# Altium schematic sheet 1-MCU.SchDoc
size A3
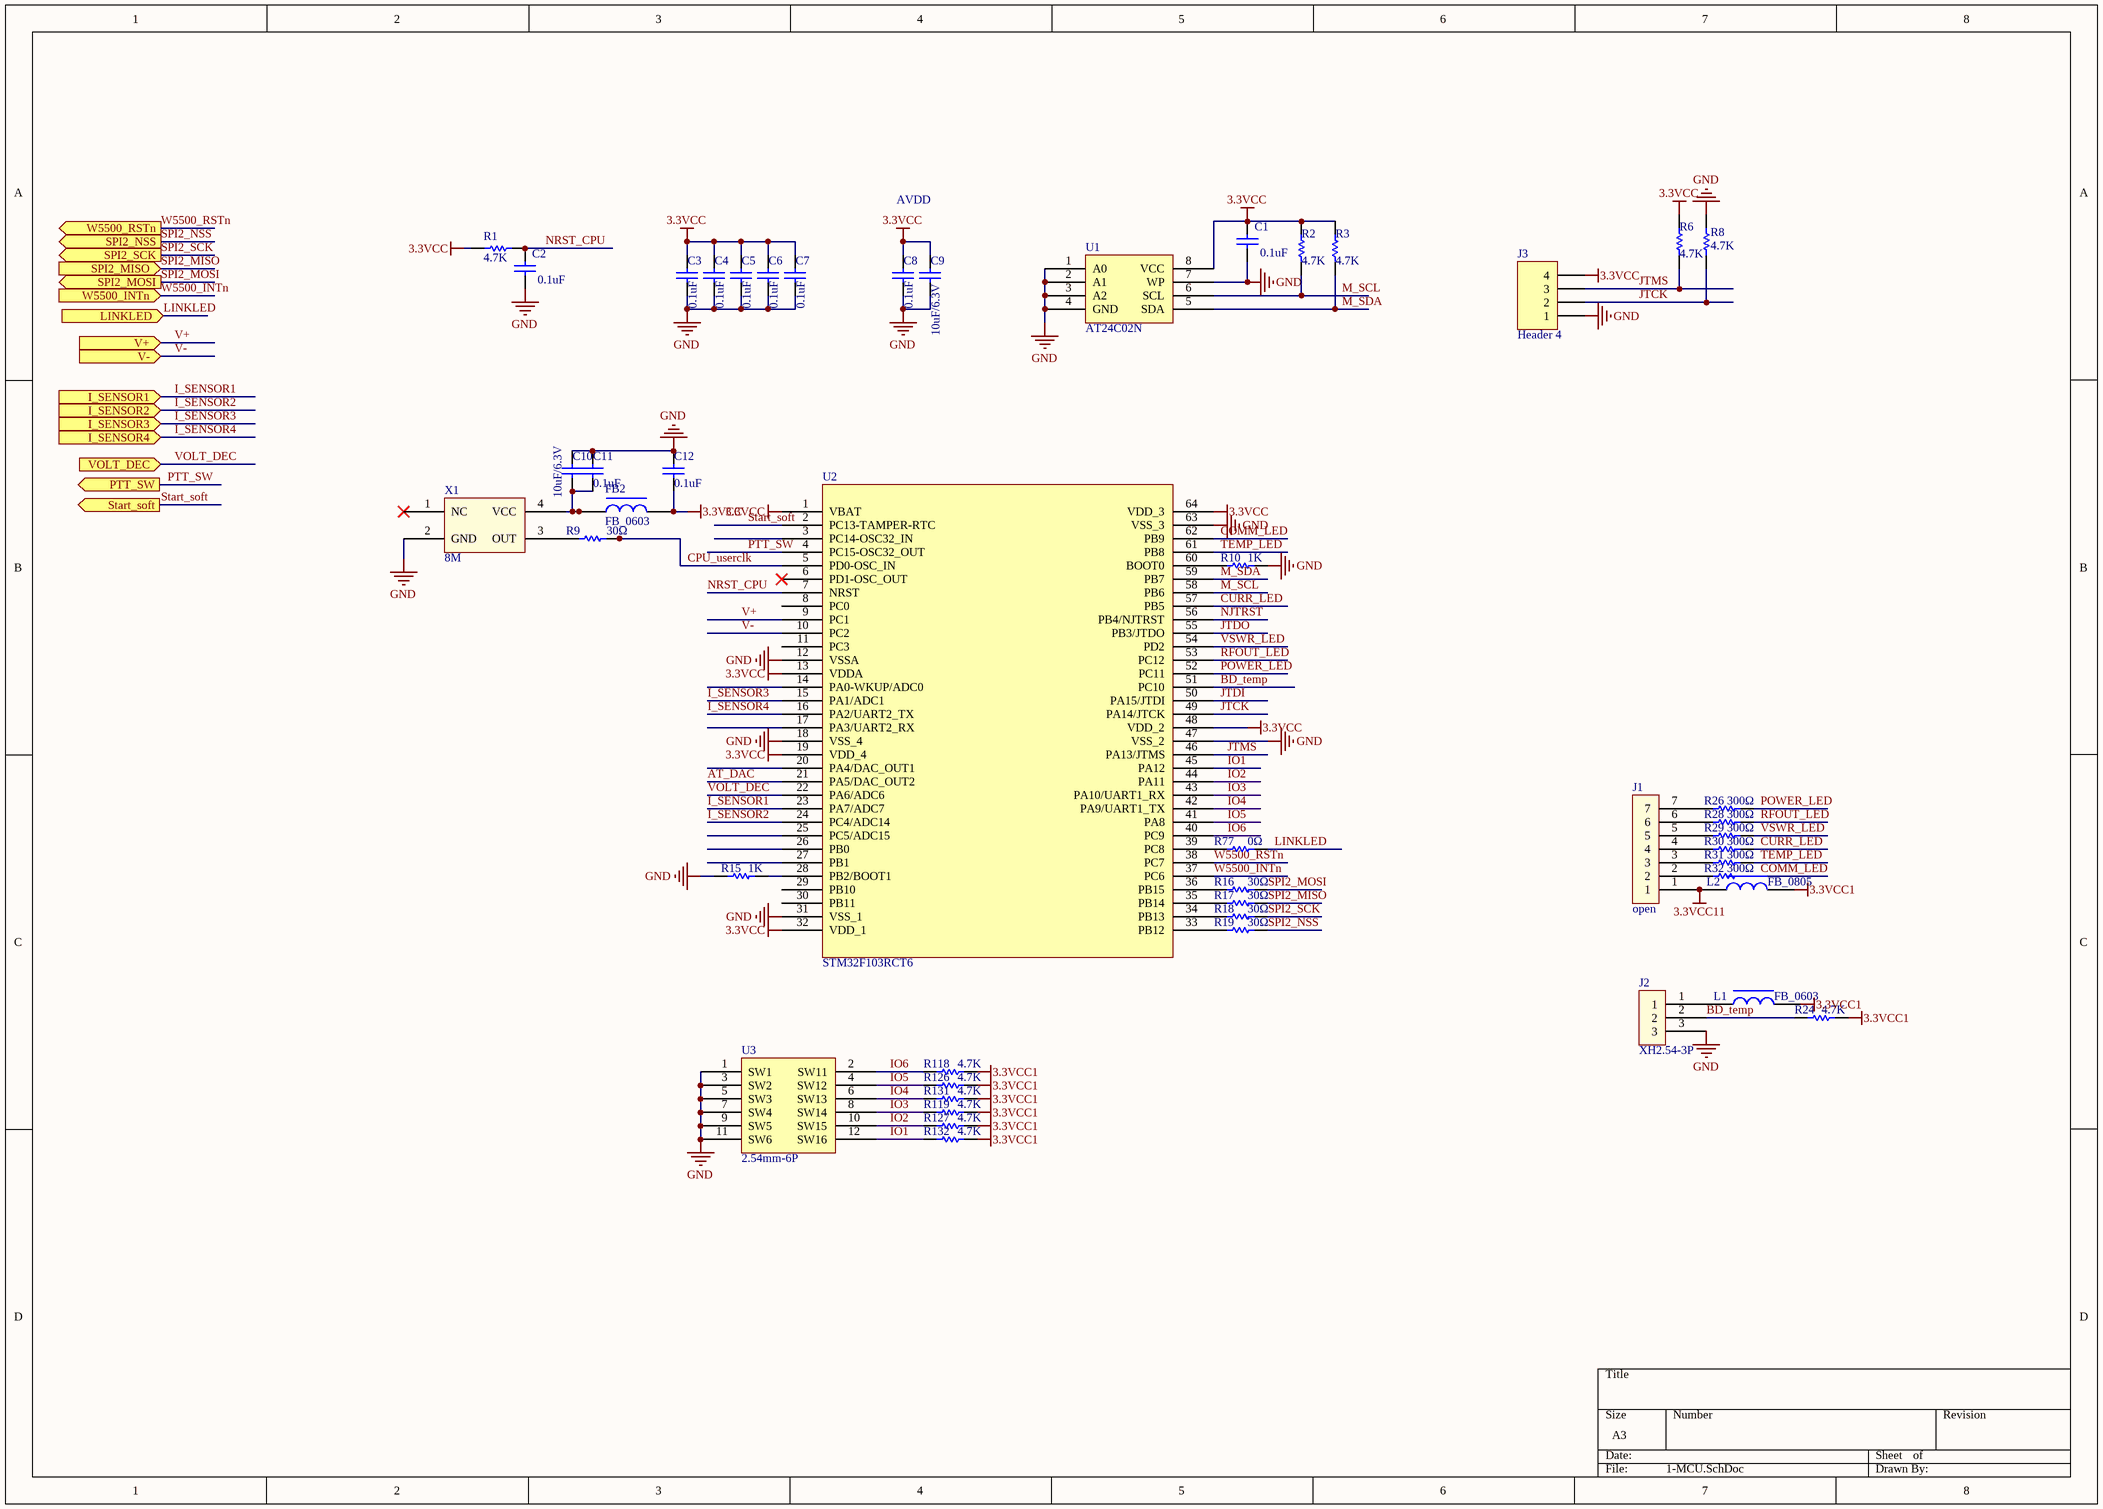
[diagram p0: 1-MCU.SchDoc]

## Parts
C1  0.1uF  [C0603]
C2  0.1uF  [C0603]
C3  0.1uF  [C0603]
C4  0.1uF  [C0603]
C5  0.1uF  [C0603]
C6  0.1uF  [C0603]
C7  0.1uF  [C0603]
C8  0.1uF  [C0603]
C9  10uF/6.3V  [C0603]
C10  10uF/6.3V  [C0603]
C11  0.1uF  [C0603]
C12  0.1uF  [C0603]
FB2  FB_0603  [L0603]
J1  open  [KF2510-7P -2R54-17R8x6R0-wanzhen]
J2  XH2.54-3P  [XH2.54mm-10R0x7R0--zhizhen]
J3  Header 4  [HDR1X4]
L1  FB_0603  [L0603]
L2  FB_0805  [L0805]
R1  4.7K  [R0603]
R2  4.7K  [R0603]
R3  4.7K  [R0603]
R6  4.7K  [R0603]
R8  4.7K  [R0603]
R9  30Ω  [R0603]
R10  1K  [R0603]
R15  1K  [R0603]
R16  30Ω  [R0603]
R17  30Ω  [R0603]
R18  30Ω  [R0603]
R19  30Ω  [R0603]
R24  4.7K  [R0603]
R26  300Ω  [R0603]
R28  300Ω  [R0603]
R29  300Ω  [R0603]
R30  300Ω  [R0603]
R31  300Ω  [R0603]
R32  300Ω  [R0603]
R77  0Ω  [R0603]
R118  4.7K  [R0603]
R119  4.7K  [R0603]
R126  4.7K  [R0603]
R127  4.7K  [R0603]
R131  4.7K  [R0603]
R132  4.7K  [R0603]
U1  AT24C02N  [SOIC8_1R27_3R9x4R9]
U2  STM32F103RCT6  [LQFP64-0R50-10x10]
U3  2.54mm-6P  [con12TM-2R54-2X6-boma]
X1  8M  [CRY4SM-5R0x7R0]

## Ports
I_SENSOR1 (in), I_SENSOR2 (in), I_SENSOR3 (in), I_SENSOR4 (in), LINKLED (in), PTT_SW (out), SPI2_MISO (in), SPI2_MOSI (out), SPI2_NSS (out), SPI2_SCK (out), Start_soft (out), V+ (in), V- (in), VOLT_DEC (in), W5500_INTn (in), W5500_RSTn (out)

## Nets
3.3VCC: C1.2 C3.2 C4.2 C5.2 C6.2 C7.2 C8.2 C9.2 C12.1 FB2.2 J3.4 R1.2 R2.2 R3.2 R6.2 U1.8(VCC) U2.1(VBAT) U2.13(VDDA) U2.19(VDD_4) U2.32(VDD_1) U2.48(VDD_2) U2.64(VDD_3)
3.3VCC1: L1.2 L2.2 R24.1 R118.2 R119.2 R126.2 R127.2 R131.2 R132.2
3.3VCC11: J1.1 L2.1
GND: C1.1 C2.1 C3.1 C4.1 C5.1 C6.1 C7.1 C8.1 C9.1 C10.1 C11.2 C12.2 J2.3 J3.1 R8.1 R10.1 R15.1 U1.1(A0) U1.2(A1) U1.3(A2) U1.4(GND) U1.7(WP) U2.12(VSSA) U2.18(VSS_4) U2.31(VSS_1) U2.47(VSS_2) U2.63(VSS_3) U3.1(SW1) U3.3(SW2) U3.5(SW3) U3.7(SW4) U3.9(SW5) U3.11(SW6) X1.2(GND)
AT_DAC: U2.21(PA5/DAC_OUT2)
BD_temp: J2.2 R24.2 U2.51(PC10)
COMM_LED: R32.2 U2.62(PB9)
CPU_userclk: R9.2 U2.5(PD0-OSC_IN)
CURR_LED: R30.2 U2.57(PB5)
I_SENSOR1: U2.23(PA7/ADC7) ; port I_SENSOR1
I_SENSOR2: U2.24(PC4/ADC14) ; port I_SENSOR2
I_SENSOR3: U2.15(PA1/ADC1) ; port I_SENSOR3
I_SENSOR4: U2.16(PA2/UART2_TX) ; port I_SENSOR4
IO1: R132.1 U2.45(PA12) U3.12(SW16)
IO2: R127.1 U2.44(PA11) U3.10(SW15)
IO3: R119.1 U2.43(PA10/UART1_RX) U3.8(SW14)
IO4: R131.1 U2.42(PA9/UART1_TX) U3.6(SW13)
IO5: R126.1 U2.41(PA8) U3.4(SW12)
IO6: R118.1 U2.40(PC9) U3.2(SW11)
JTCK: J3.2 R8.2 U2.49(PA14/JTCK)
JTDI: U2.50(PA15/JTDI)
JTDO: U2.55(PB3/JTDO)
JTMS: J3.3 R6.1 U2.46(PA13/JTMS)
LINKLED: R77.2 ; port LINKLED
M_SCL: R2.1 U1.6(SCL) U2.58(PB6)
M_SDA: R3.1 U1.5(SDA) U2.59(PB7)
NJTRST: U2.56(PB4/NJTRST)
NRST_CPU: C2.2 R1.1 U2.7(NRST)
POWER_LED: R26.2 U2.52(PC11)
PTT_SW: U2.4(PC15-OSC32_OUT) ; port PTT_SW
RFOUT_LED: R28.2 U2.53(PC12)
SPI2_MISO: R17.2 ; port SPI2_MISO
SPI2_MOSI: R16.2 ; port SPI2_MOSI
SPI2_NSS: R19.2 ; port SPI2_NSS
SPI2_SCK: R18.2 ; port SPI2_SCK
Start_soft: U2.2(PC13-TAMPER-RTC) ; port Start_soft
TEMP_LED: R31.2 U2.61(PB8)
V+: U2.9(PC1) ; port V+
V-: U2.10(PC2) ; port V-
VOLT_DEC: U2.22(PA6/ADC6) ; port VOLT_DEC
VSWR_LED: R29.2 U2.54(PD2)
W5500_INTn: U2.37(PC6) ; port W5500_INTn
W5500_RSTn: U2.38(PC7) ; port W5500_RSTn
NetC10_2: C10.2 C11.1 FB2.1 X1.4(VCC)
NetJ1_2: J1.2 R32.1
NetJ1_3: J1.3 R31.1
NetJ1_4: J1.4 R30.1
NetJ1_5: J1.5 R29.1
NetJ1_6: J1.6 R28.1
NetJ1_7: J1.7 R26.1
NetJ2_1: J2.1 L1.1
NetR9_1: R9.1 X1.3(OUT)
NetR10_2: R10.2 U2.60(BOOT0)
NetR15_2: R15.2 U2.28(PB2/BOOT1)
NetR16_1: R16.1 U2.36(PB15)
NetR17_1: R17.1 U2.35(PB14)
NetR18_1: R18.1 U2.34(PB13)
NetR19_1: R19.1 U2.33(PB12)
NetR77_1: R77.1 U2.39(PC8)

Not connected (* = marked no-connect by the designer): U2 3(PC14-OSC32_IN) 6(PD1-OSC_OUT)* 8(PC0) 11(PC3) 14(PA0-WKUP/ADC0) 17(PA3/UART2_RX) 20(PA4/DAC_OUT1) 25(PC5/ADC15) 26(PB0) 27(PB1) 29(PB10) 30(PB11); X1 1(NC)*

## Notes on the sheet
- AVDD

## Library data of the parts
C1-C8 C11 C12 = 0.1uF贴片电容: 贴片电容_GRM188R71H104KA01D_0.1uF±10%,50V,0603; code: 01010045
C9 C10 = 10uF贴片电容: 贴片电容_GRM188R60J106ME47D_10uF±20%,6.3V,0603; code: 01010037
FB2 = 0603贴片磁珠: 贴片磁珠_100R,0603; code: 0103016
J1 = KF2510-7P连接器: 连接器_KF2510-7P_直插,间距2.54mm; code: 01090014
J2 = XH2.54-3P: 连接器_XH2.54-3P_弯针,间距2.54mm
J3 = Header 4: Header, 4-Pin; LatestRevisionDate: 17-Jul-2002; LatestRevisionNote: Re-released for DXP Platform.; Publisher: Altium Limited
L1 = 0805贴片磁珠: 贴片磁珠_600R,0805
L2 = 0805贴片磁珠: 贴片磁珠_600R,0805; code: 01030023
R1-R3 R6 R24 = 4.7K贴片电阻: 贴片电阻_4.7K±5%,0603; code: 01020012
R8 R10 R15 = 1K贴片电阻: 贴片电阻_1K±5%,0603; code: 01020082
R9 R16-R19 = 30Ω贴片电阻: 贴片电阻_30Ω±5%,0603; code: 01020108
R26 R28-R32 = 300Ω贴片电阻: 贴片电阻_300Ω±5%,0603; code: 01020008
R77 = 0Ω贴片电阻: 贴片电阻_0Ω±5%,0603; code: 01020010
R118 R119 R126 R127 R131 R132 = 1.5K贴片电阻: 贴片电阻_4.7K±5%,0603; code: 01020012
U1 = AT24C02N: EEPROM_AT24C02N_SOIC8; Maker: ATMEL; code: 01060068
U2 = STM32F103RCT6: MCU_STM32F103RCT6_32bit,LQFP64; code: 01060070; maker: ST
U3 = 拨码开关: 拨码开关_2.54mm-6P_侧拨
X1 = 16M贴片有源晶振: 贴片有源晶振_8M,20ppm,封装5x7